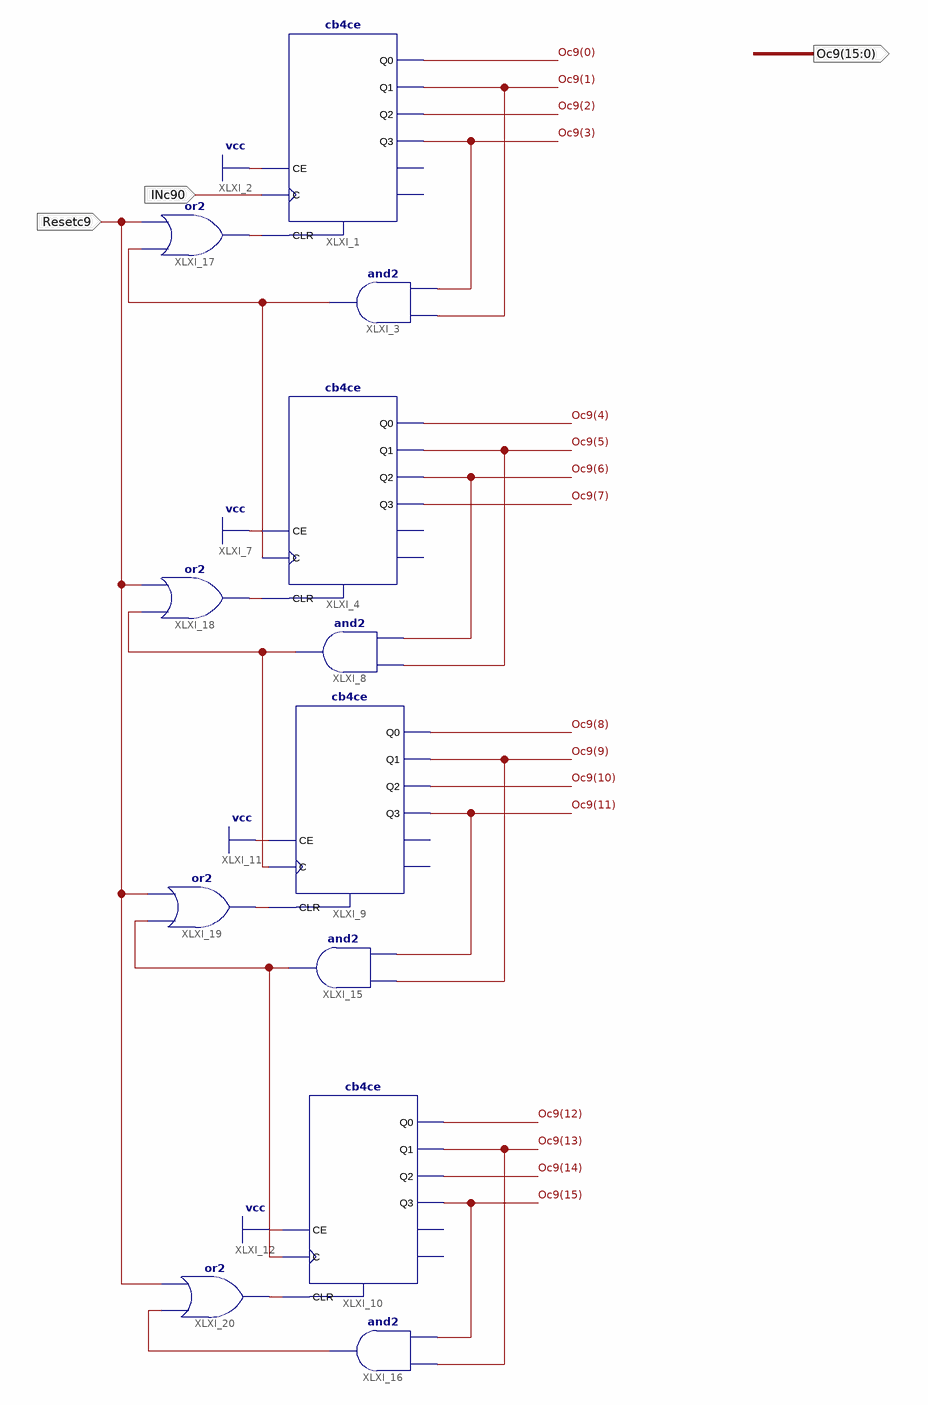
[diagram p0: schematic sheet 1]
// Xilinx ISE schematic c9.sch (spartan6) as structural Verilog: 12 symbols, 3 ports
module c9 (
  input  INc90,
  input  Resetc9,
  output [15:0] Oc9
);

  wire XLXN_37, XLXN_39, XLXN_40, XLXN_41, XLXN_42, XLXN_46, XLXN_47, XLXN_48;

  cb4ce XLXI_1 (
    .C(INc90), .CE(1'b1), .CLR(XLXN_37), .Q0(Oc9[0]), .Q1(Oc9[1]), .Q2(Oc9[2]), .Q3(Oc9[3]));  // open: CEO, TC
  and XLXI_3 (XLXN_39, Oc9[3], Oc9[1]);
  cb4ce XLXI_4 (
    .C(XLXN_39), .CE(1'b1), .CLR(XLXN_40), .Q0(Oc9[4]), .Q1(Oc9[5]), .Q2(Oc9[6]), .Q3(Oc9[7]));  // open: CEO, TC
  and XLXI_8 (XLXN_48, Oc9[6], Oc9[5]);
  cb4ce XLXI_9 (
    .C(XLXN_48), .CE(1'b1), .CLR(XLXN_41), .Q0(Oc9[8]), .Q1(Oc9[9]), .Q2(Oc9[10]), .Q3(Oc9[11]));  // open: CEO, TC
  cb4ce XLXI_10 (
    .C(XLXN_47), .CE(1'b1), .CLR(XLXN_42), .Q0(Oc9[12]), .Q1(Oc9[13]), .Q2(Oc9[14]), .Q3(Oc9[15]));  // open: CEO, TC
  and XLXI_15 (XLXN_47, Oc9[11], Oc9[9]);
  and XLXI_16 (XLXN_46, Oc9[15], Oc9[13]);
  or XLXI_17 (XLXN_37, XLXN_39, Resetc9);
  or XLXI_18 (XLXN_40, XLXN_48, Resetc9);
  or XLXI_19 (XLXN_41, XLXN_47, Resetc9);
  or XLXI_20 (XLXN_42, XLXN_46, Resetc9);
endmodule
